# Altium schematic sheet MCU.SchDoc
size A3; SheetNumber: 1; SheetTotal: 5
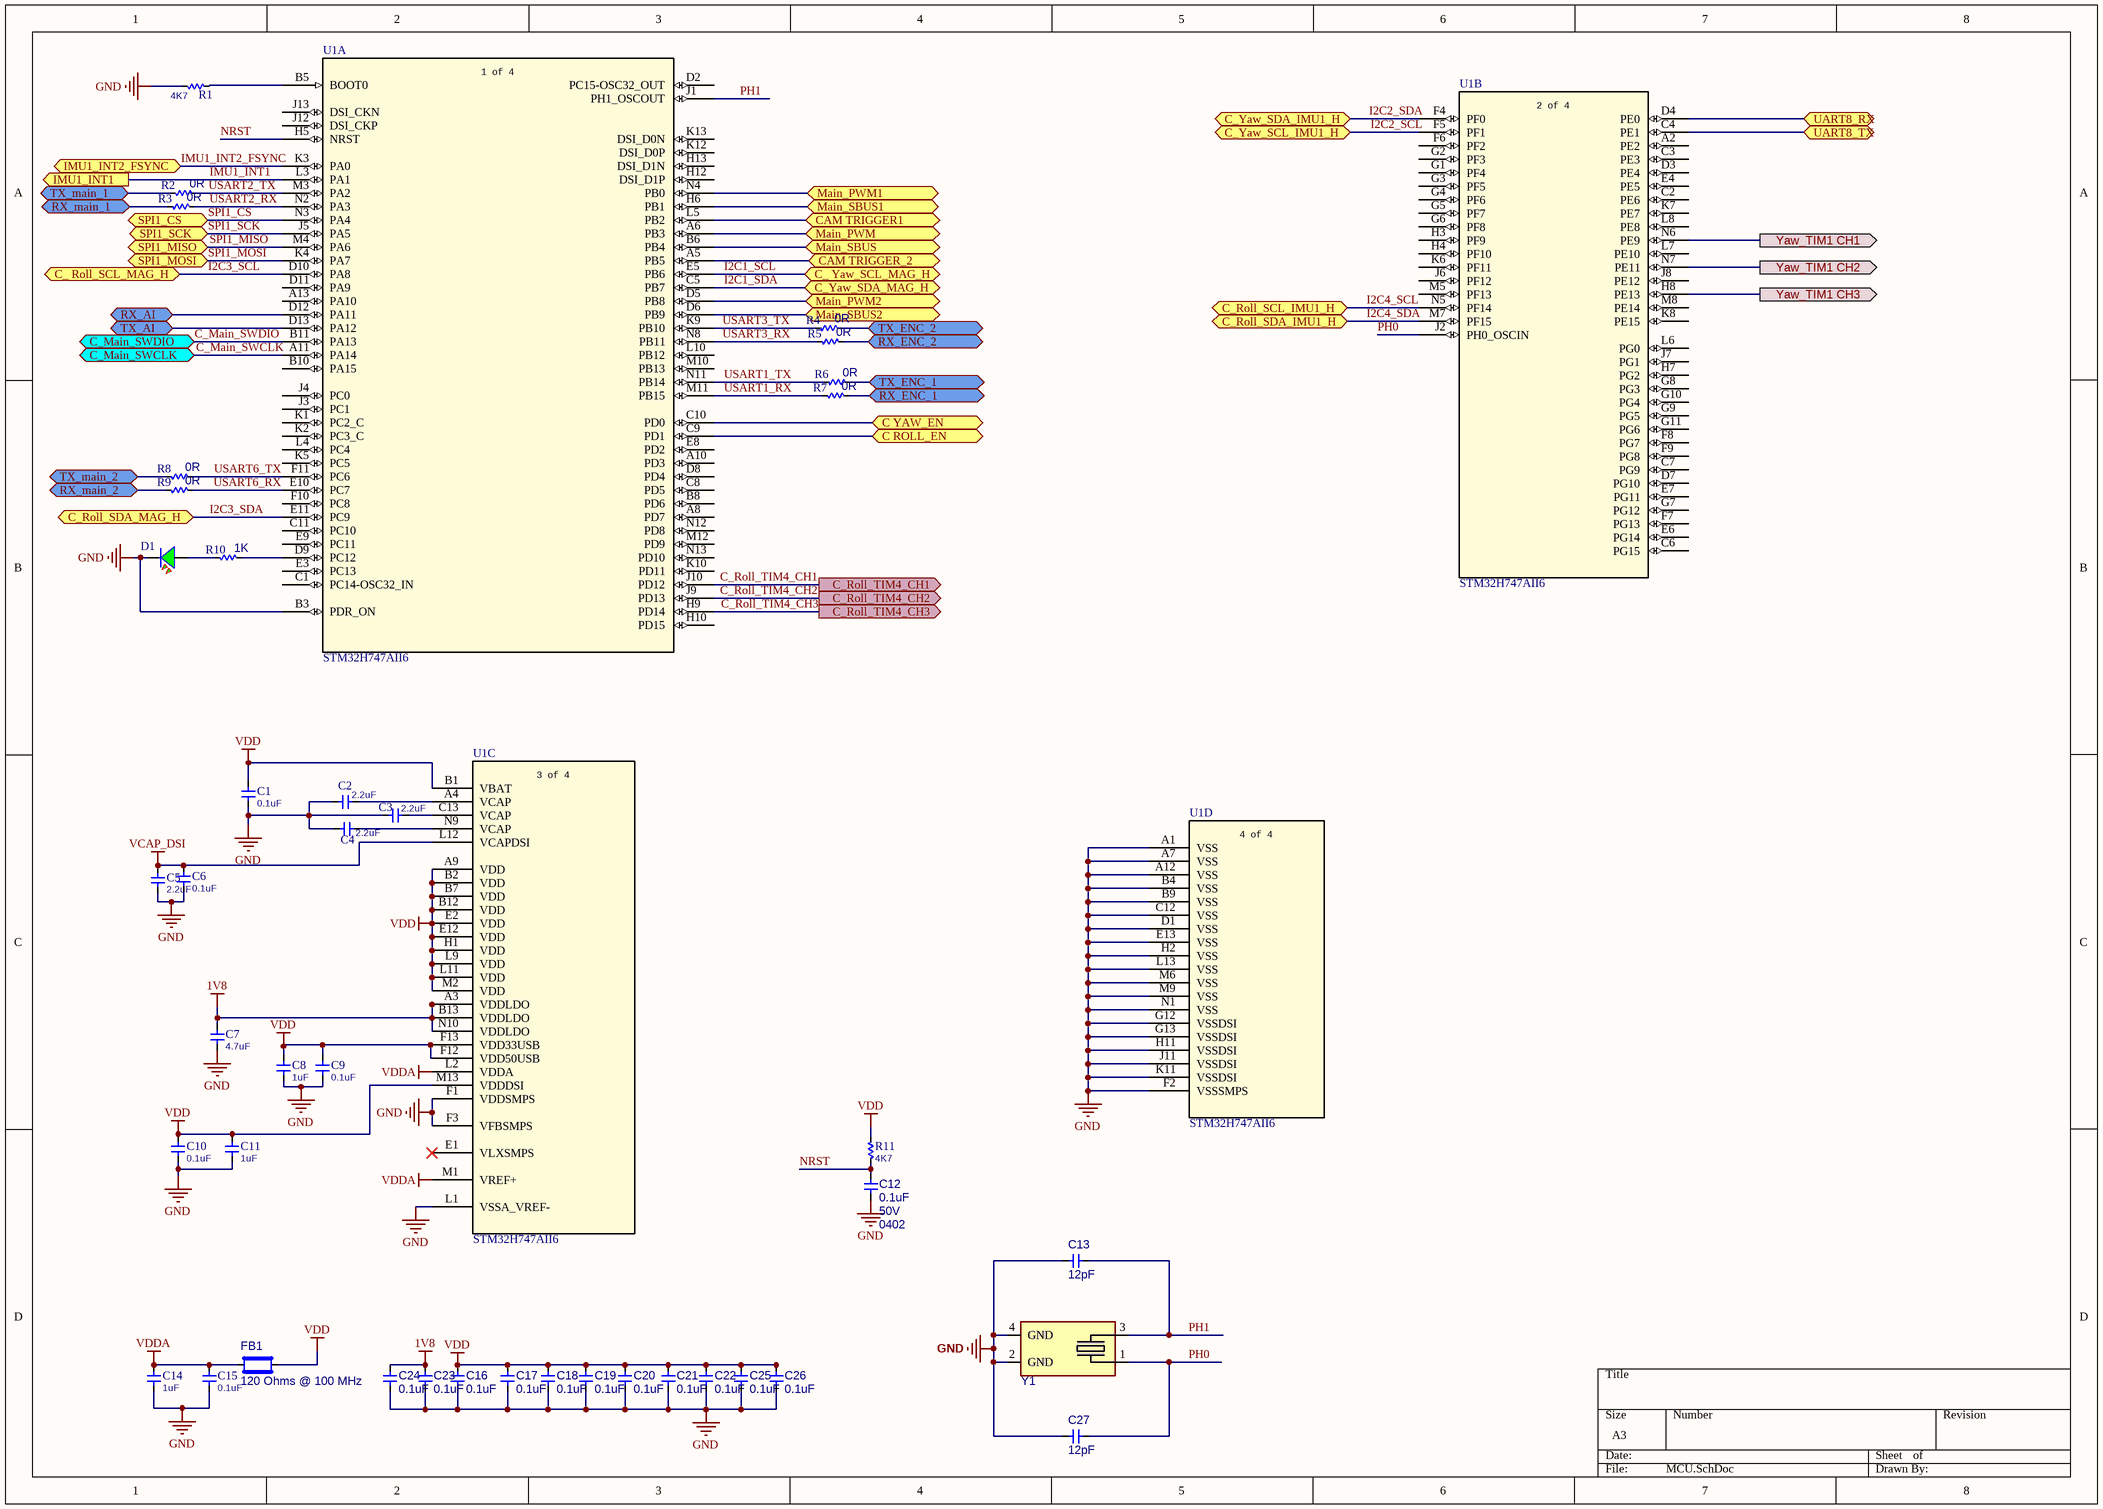
[diagram p0: MCU.SchDoc]

## Parts
C1  value 0.1uF  [CAP0402]  (hidden comment: CAP0402)
C2  value 2.2uF  [CAP0402]  (hidden comment: CAP0402)
C3  value 2.2uF  [CAP0402]  (hidden comment: CAP0402)
C4  value 2.2uF  [CAP0402]  (hidden comment: CAP0402)
C5  value 2.2uF  [CAP0402]  (hidden comment: CAP0402)
C6  value 0.1uF  [CAP0402]  (hidden comment: CAP0402)
C7  value 4.7uF  [CAP0402]  (hidden comment: CAP0402)
C8  value 1uF  [CAP0402]  (hidden comment: CAP0402)
C9  value 0.1uF  [CAP0402]  (hidden comment: CAP0402)
C10  value 0.1uF  [CAP0402]  (hidden comment: CAP0402)
C11  value 1uF  [CAP0402]  (hidden comment: CAP0402)
C12  value 0.1uF  Voltage: 50V  Package: 0402  [CAP0402]  (hidden comment: CAP0402 0.1uF 50V)
C13  value 12pF  [CAP0402]  (hidden comment: CAP0402 12pF 50V)
C14  value 1uF  [CAP0402]  (hidden comment: CAP0402)
C15  value 0.1uF  [CAP0402]  (hidden comment: CAP0402)
C16  value 0.1uF  [CAP0402]  (hidden comment: CAP0402 0.1uF 50V)
C17  value 0.1uF  [CAP0402]  (hidden comment: CAP0402 0.1uF 50V)
C18  value 0.1uF  [CAP0402]  (hidden comment: CAP0402 0.1uF 50V)
C19  value 0.1uF  [CAP0402]  (hidden comment: CAP0402 0.1uF 50V)
C20  value 0.1uF  [CAP0402]  (hidden comment: CAP0402 0.1uF 50V)
C21  value 0.1uF  [CAP0402]  (hidden comment: CAP0402 0.1uF 50V)
C22  value 0.1uF  [CAP0402]  (hidden comment: CAP0402 0.1uF 50V)
C23  value 0.1uF  [CAP0402]  (hidden comment: CAP0402 0.1uF 50V)
C24  value 0.1uF  [CAP0402]  (hidden comment: CAP0402 0.1uF 50V)
C25  value 0.1uF  [CAP0402]  (hidden comment: CAP0402 0.1uF 50V)
C26  value 0.1uF  [CAP0402]  (hidden comment: CAP0402 0.1uF 50V)
C27  value 12pF  [CAP0402]  (hidden comment: CAP0402 12pF 50V)
D1  SML-310MTT86  [LED0603 GREEN]  (value not drawn)
FB1  Impedance @ Frequency: 120 Ohms @ 100 MHz  [FERRIT0402]  (hidden comment: BLM15PX121SZ1D)
R1  value 4K7  [RES0402]  (hidden comment: RES0402 4K7)
R2  value 0R  [RES0402]  (hidden comment: RES0402 0R)
R3  value 0R  [RES0402]  (hidden comment: RES0402 0R)
R4  value 0R  [RES0402]  (hidden comment: RES0402 0R)
R5  value 0R  [RES0402]  (hidden comment: RES0402 0R)
R6  value 0R  [RES0402]  (hidden comment: RES0402 0R)
R7  value 0R  [RES0402]  (hidden comment: RES0402 0R)
R8  value 0R  [RES0402]  (hidden comment: RES0402 0R)
R9  value 0R  [RES0402]  (hidden comment: RES0402 0R)
R10  value 1K  [RES0402]  (hidden comment: RES0402 0R)
R11  value 4K7  [RES0402]  (hidden comment: RES0402 4K7)
U1  STM32H747AII6  [UFBGA169]  (parts A,B,C,D of 4)
Y1  ECS-240-12-37B-CKY-TR  [XTAL_ECS-240-12-37B-CKY-TR]  (value not drawn)

## Ports
C ROLL_EN (bidir), C YAW_EN (bidir), C_ Roll_SCL_MAG_H (bidir), C_ Yaw_SCL_MAG_H (bidir), C_Main_SWCLK (bidir), C_Main_SWDIO (bidir), C_Roll_SCL_IMU1_H (bidir), C_Roll_SDA_IMU1_H (bidir), C_Roll_SDA_MAG_H (bidir), C_Roll_TIM4_CH1 (out), C_Roll_TIM4_CH2 (out), C_Roll_TIM4_CH3 (out), C_Yaw_SCL_IMU1_H (bidir), C_Yaw_SDA_IMU1_H (bidir), C_Yaw_SDA_MAG_H (bidir), CAM TRIGGER1 (bidir), CAM TRIGGER_2 (bidir), IMU1_INT1 (out), IMU1_INT2_FSYNC (bidir), Main_PWM1 (bidir), Main_PWM2 (bidir), Main_PWM (bidir), Main_SBUS1 (bidir), Main_SBUS2 (bidir), Main_SBUS (bidir), RX_AI (bidir), RX_ENC_1 (bidir), RX_ENC_2 (bidir), RX_main_1 (bidir), RX_main_2 (bidir), SPI1_CS (bidir), SPI1_MISO (bidir), SPI1_MOSI (bidir), SPI1_SCK (bidir), TX_AI (bidir), TX_ENC_1 (bidir), TX_ENC_2 (bidir), TX_main_1 (bidir), TX_main_2 (bidir), UART8_RX (bidir), UART8_TX (bidir), Yaw_TIM1 CH1 (out), Yaw_TIM1 CH2 (out), Yaw_TIM1 CH3 (out)

## Nets
1V8: C7.2 C23.2 C24.2 U1.A3(VDDLDO) U1.B13(VDDLDO) U1.N10(VDDLDO)
GND: C1.1 C2.1 C3.1 C4.1 C5.1 C6.1 C7.1 C8.1 C9.1 C10.1 C11.1 C12.1 C13.2 C14.1 C15.1 C16.1 C17.1 C18.1 C19.1 C20.1 C21.1 C22.1 C23.1 C24.1 C25.1 C26.1 C27.2 D1.1 R1.1 U1.A1(VSS) U1.A7(VSS) U1.A12(VSS) U1.B3(PDR_ON) U1.B4(VSS) U1.B9(VSS) U1.C12(VSS) U1.D1(VSS) U1.E13(VSS) U1.F1(VDDSMPS) U1.F2(VSSSMPS) U1.F3(VFBSMPS) U1.G12(VSSDSI) U1.G13(VSSDSI) U1.H2(VSS) U1.H11(VSSDSI) U1.J11(VSSDSI) U1.K11(VSSDSI) U1.L1(VSSA_VREF-) U1.L13(VSS) U1.M6(VSS) U1.M9(VSS) U1.N1(VSS) Y1.2(GND) Y1.4(GND)
VCAP_DSI: C5.2 C6.2 U1.L12(VCAPDSI)
VDD: C1.2 C8.2 C9.2 C10.2 C11.2 C16.2 C17.2 C18.2 C19.2 C20.2 C21.2 C22.2 C25.2 C26.2 FB1.2 R11.2 U1.A9(VDD) U1.B1(VBAT) U1.B2(VDD) U1.B7(VDD) U1.B12(VDD) U1.E2(VDD) U1.E12(VDD) U1.F12(VDD50USB) U1.F13(VDD33USB) U1.H1(VDD) U1.L9(VDD) U1.L11(VDD) U1.M2(VDD) U1.M13(VDDDSI)
VDDA: C14.2 C15.2 FB1.1 U1.L2(VDDA) U1.M1(VREF+)
C ROLL_EN: U1.C9(PD1) ; port C ROLL_EN
C YAW_EN: U1.C10(PD0) ; port C YAW_EN
C_Main_SWCLK: U1.A11(PA14) ; port C_Main_SWCLK
C_Main_SWDIO: U1.B11(PA13) ; port C_Main_SWDIO
C_Roll_TIM4_CH1: U1.J10(PD12) ; port C_Roll_TIM4_CH1
C_Roll_TIM4_CH2: U1.J9(PD13) ; port C_Roll_TIM4_CH2
C_Roll_TIM4_CH3: U1.H9(PD14) ; port C_Roll_TIM4_CH3
CAM TRIGGER1: U1.L5(PB2) ; port CAM TRIGGER1
CAM TRIGGER_2: U1.A5(PB5) ; port CAM TRIGGER_2
I2C1_SCL: U1.E5(PB6) ; port C_ Yaw_SCL_MAG_H
I2C1_SDA: U1.C5(PB7) ; port C_Yaw_SDA_MAG_H
I2C2_SCL: U1.F5(PF1) ; port C_Yaw_SCL_IMU1_H
I2C2_SDA: U1.F4(PF0) ; port C_Yaw_SDA_IMU1_H
I2C3_SCL: U1.D10(PA8) ; port C_ Roll_SCL_MAG_H
I2C3_SDA: U1.E11(PC9) ; port C_Roll_SDA_MAG_H
I2C4_SCL: U1.N5(PF14) ; port C_Roll_SCL_IMU1_H
I2C4_SDA: U1.M7(PF15) ; port C_Roll_SDA_IMU1_H
IMU1_INT1: U1.L3(PA1) ; port IMU1_INT1
IMU1_INT2_FSYNC: U1.K3(PA0) ; port IMU1_INT2_FSYNC
Main_PWM: U1.A6(PB3) ; port Main_PWM
Main_PWM1: U1.N4(PB0) ; port Main_PWM1
Main_PWM2: U1.D5(PB8) ; port Main_PWM2
Main_SBUS: U1.B6(PB4) ; port Main_SBUS
Main_SBUS1: U1.H6(PB1) ; port Main_SBUS1
Main_SBUS2: U1.D6(PB9) ; port Main_SBUS2
NRST: C12.2 R11.1 U1.H5(NRST)
PH0: C27.1 U1.J2(PH0_OSCIN) Y1.1(IO)
PH1: C13.1 U1.J1(PH1_OSCOUT) Y1.3(IO)
RX_AI: U1.D12(PA11) ; port RX_AI
RX_ENC_1: R7.2 ; port RX_ENC_1
RX_ENC_2: R5.2 ; port RX_ENC_2
RX_main_1: R3.1 ; port RX_main_1
RX_main_2: R9.1 ; port RX_main_2
SPI1_CS: U1.N3(PA4) ; port SPI1_CS
SPI1_MISO: U1.M4(PA6) ; port SPI1_MISO
SPI1_MOSI: U1.K4(PA7) ; port SPI1_MOSI
SPI1_SCK: U1.J5(PA5) ; port SPI1_SCK
TX_AI: U1.D13(PA12) ; port TX_AI
TX_ENC_1: R6.2 ; port TX_ENC_1
TX_ENC_2: R4.2 ; port TX_ENC_2
TX_main_1: R2.1 ; port TX_main_1
TX_main_2: R8.1 ; port TX_main_2
UART8_RX: U1.D4(PE0) ; port UART8_RX
UART8_TX: U1.C4(PE1) ; port UART8_TX
USART1_RX: R7.1 U1.M11(PB15)
USART1_TX: R6.1 U1.N11(PB14)
USART2_RX: R3.2 U1.N2(PA3)
USART2_TX: R2.2 U1.M3(PA2)
USART3_RX: R5.1 U1.N8(PB11)
USART3_TX: R4.1 U1.K9(PB10)
USART6_RX: R9.2 U1.E10(PC7)
USART6_TX: R8.2 U1.F11(PC6)
Yaw_TIM1 CH1: U1.N6(PE9) ; port Yaw_TIM1 CH1
Yaw_TIM1 CH2: U1.N7(PE11) ; port Yaw_TIM1 CH2
Yaw_TIM1 CH3: U1.H8(PE13) ; port Yaw_TIM1 CH3
NetC2_2: C2.2 U1.A4(VCAP)
NetC3_2: C3.2 U1.C13(VCAP)
NetC4_2: C4.2 U1.N9(VCAP)
NetD1_2: D1.2 R10.1
NetR1_2: R1.2 U1.B5(BOOT0)
NetR10_2: R10.2 U1.D9(PC12)

Not connected (* = marked no-connect by the designer): U1 A2(PE2) A8(PD7) A10(PD3) A13(PA10) B8(PD6) B10(PA15) C1(PC14-OSC32_IN) C2(PE6) C3(PE3) C6(PG15) C7(PG9) C8(PD5) C11(PC10) D2(PC15-OSC32_OUT) D3(PE4) D7(PG10) D8(PD4) D11(PA9) E1(VLXSMPS)* E3(PC13) E4(PE5) E6(PG14) E7(PG11) E8(PD2) E9(PC11) F6(PF2) F7(PG13) F8(PG7) F9(PG8) F10(PC8) G1(PF4) G2(PF3) G3(PF5) G4(PF6) G5(PF7) G6(PF8) G7(PG12) G8(PG3) G9(PG5) G10(PG4) G11(PG6) H3(PF9) H4(PF10) H7(PG2) H10(PD15) H12(DSI_D1P) H13(DSI_D1N) J3(PC1) J4(PC0) J6(PF12) J7(PG1) J8(PE12) J12(DSI_CKP) J13(DSI_CKN) K1(PC2_C) K2(PC3_C) K5(PC5) K6(PF11) K7(PE7) K8(PE15) K10(PD11) K12(DSI_D0P) K13(DSI_D0N) L4(PC4) L6(PG0) L7(PE10) L8(PE8) L10(PB12) M5(PF13) M8(PE14) M10(PB13) M12(PD9) N12(PD8) N13(PD10)

## Notes on the sheet
- (in symbol STM32H747AII6, part A) 1 of 4
- (in symbol STM32H747AII6, part B) 2 of 4
- (in symbol STM32H747AII6, part C) 3 of 4
- (in symbol STM32H747AII6, part D) 4 of 4

## Library data of the parts
C1-C11 C14 C15 = CAP0402: Cap 0402; MP: add later
C12 C16-C26 = CAP0402 0.1uF 50V: Cap 0.1uF 50V 0402; MP: CC0402KRX5R9BB104
  C16-C26: Voltage: 50V; Package: 0402
C13 C27 = CAP0402 12pF 50V: Cap 12pF 50V 0402
D1 = CMP-01130-2: LED GREEN CLEAR 0603 SMD; Manufacturer 1: Rohm Semiconductor; Luminous Intensity: 16mcd; Wavelength: 570nm; Number of LEDs: 1; Color: Green,Yellow; Forward Voltage: 2.2V; Lens Color: Colorless,Clear; Forward Current: 20mA; Viewing Angle: 140°; Lens Style: Rectangular,Clear,Diffused,Colorless; Case Code (Imperial): 0603; Lens Transparency: Clear; Package Quantity: 3000; Width: 0.8mm; Manufacturer Part Number 1: SML-310MTT86; Min Operating Temperature: -30°C; Length: 1.6mm; Packaging: Tape and Reel; Dominant Wavelength: 570nm; Height: 0.9mm; Radiation Hardening: No; Test Current: 20mA; Case Code (Metric): 1608; Lead Free: Lead Free; Case/Package: 0603; Mount: Surface Mount; Max Operating Temperature: 85°C; Illumination Color: Green; Number of Pins: 2
FB1 = BLM15PX121SZ1D: 120 Ohms @ 100 MHz 1 Power Line Ferrite Bead 0402 (1005 Metric) 2A 55mOhm; MP: BLM15PX121SZ1D; Current Rating (Max): 2A; DC Resistance (DCR) (Max): 55mOhm
R1 R11 = RES0402 4K7: RES 4K7 0402; MP: RC0402JR-074K7L
R2-R10 = RES0402 0R: RES 0R 0402; MP: RC0402JR-070RL
U1 = STM32H747AII6: High-performance and DSP with DP-FPU, Arm Cortex-M7 + Cortex-M4 MCU with 2MBytes of Flash memory, 1MB RAM, 480 MHz CPU, Art Accelerator, L1 cache, external memory interface, large set of peripherals, SMPS, MIPI-DSI; Manufacturer_Name: STMicroelectronics; Copyright: Copyright (C) 2026 Ultra Librarian. All rights reserved.; Manufacturer_Part_Number: STM32H747AII6; RefDes: RefDes; Type: Type
Y1 = ECS-240-12-37B-CKY-TR: Crystal 24 MHz ±10ppm 12pF 50 Ohms 4-SMD, No Lead; Frequency: 24 MHz; ESR (Equivalent Series Resistance): 50 Ohms; MP: ECS-240-12-37B-CKY-TR; Frequency Stability: ±10ppm; Frequency Tolerance: ±10ppm; Load Capacitance: 12pF; Operating Temperature: -30°C ~ 85°C; Size / Dimension: 2.00mm x 1.60mm